# EAGLE design Orgel (EAGLE 7.2.0)
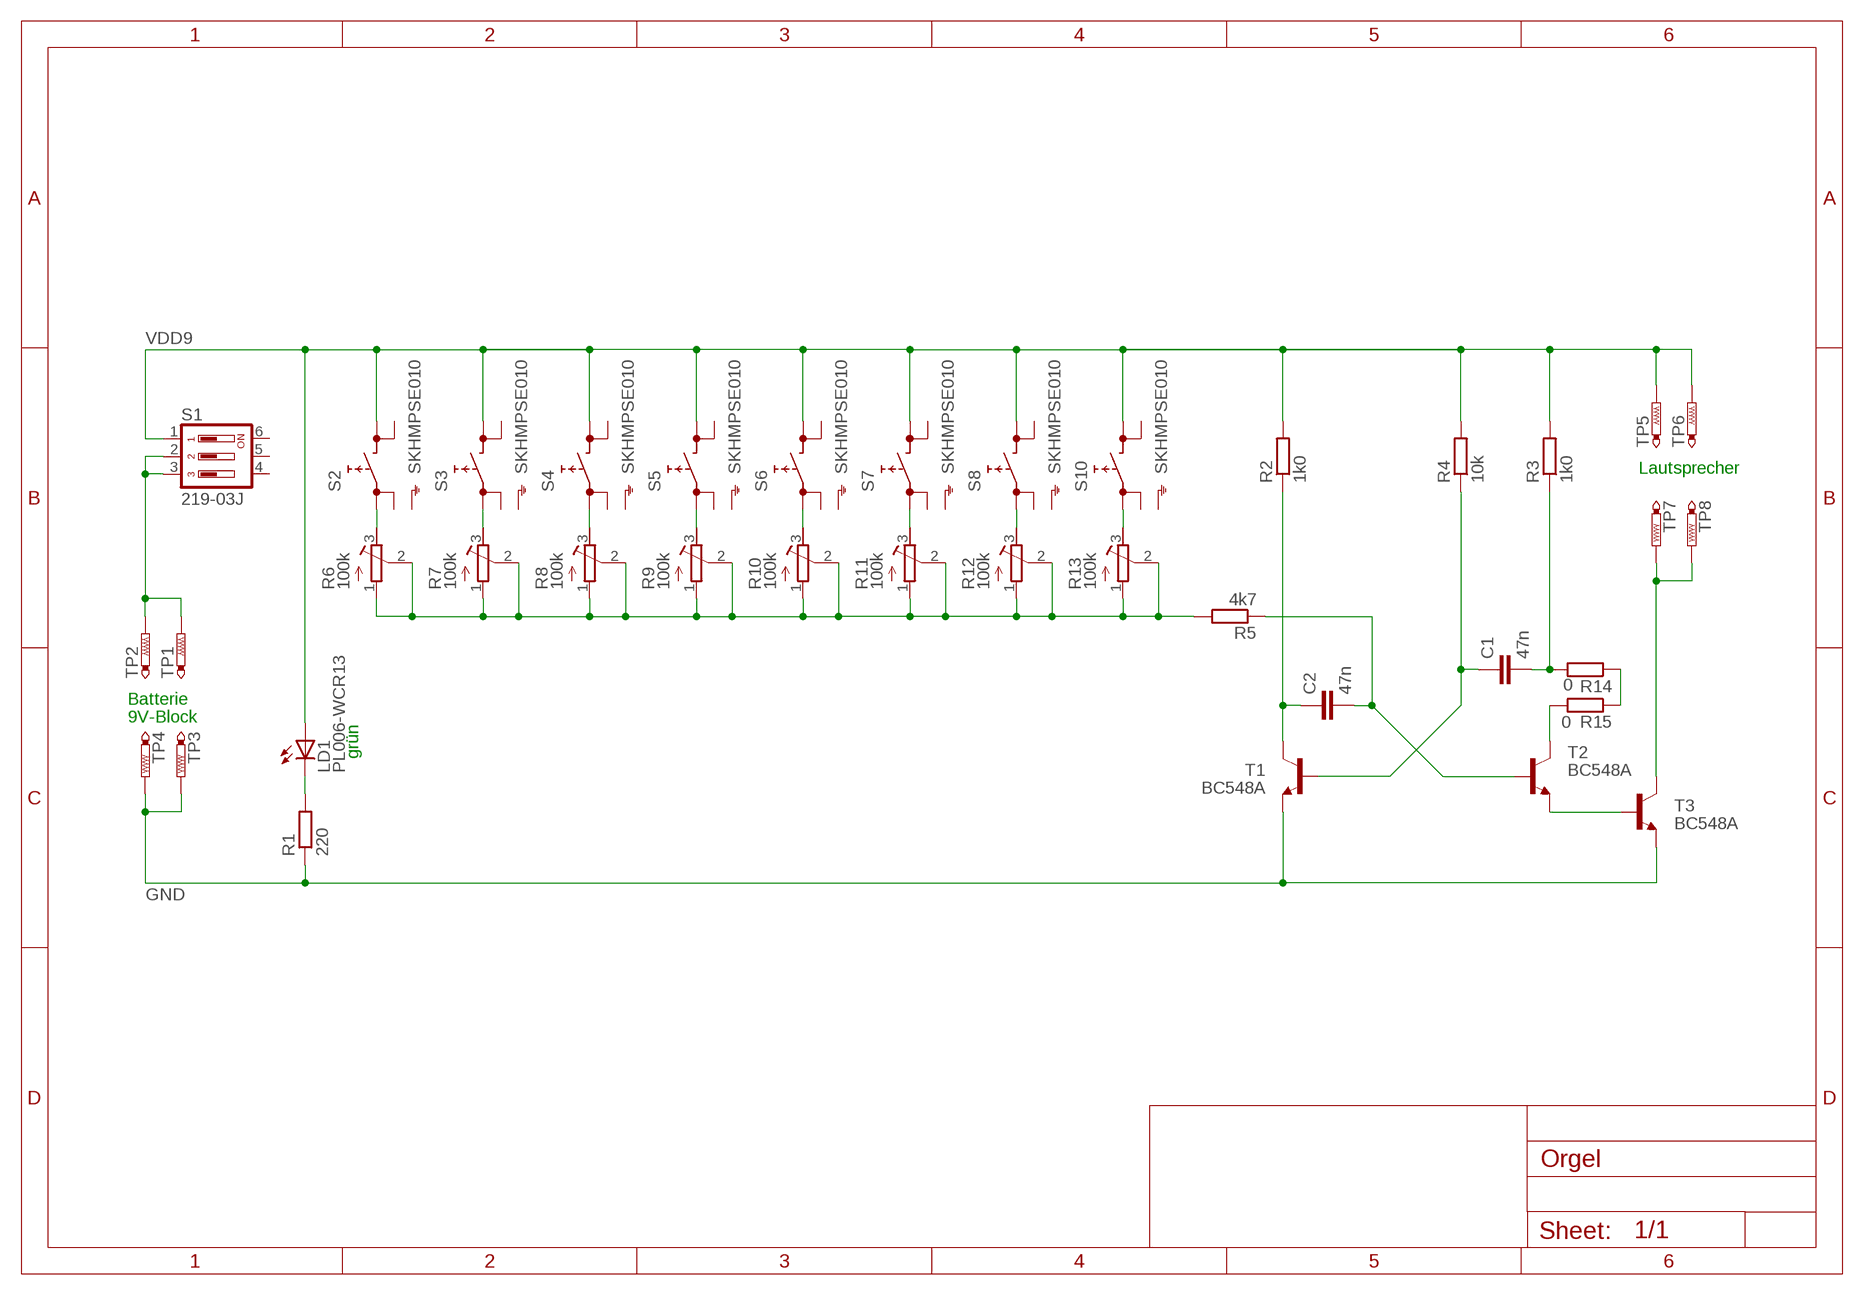
[diagram p0: schematic, sheet 1]

## Parts
C1  47n  C-EUC1206  [C1206]
C2  47n  C-EUC1206  [C1206]
LD1  PL006-WCR13  [SOT23]
R1  220  R-EU_M1206  [M1206]
R2  1k0  R-EU_M1206  [M1206]
R3  1k0  R-EU_M1206  [M1206]
R4  10k  R-EU_M1206  [M1206]
R5  4k7  R-EU_M1206  [M1206]
R6  100k  R-TRIMM5X  [RTRIM5X]
R7  100k  R-TRIMM5X  [RTRIM5X]
R8  100k  R-TRIMM5X  [RTRIM5X]
R9  100k  R-TRIMM5X  [RTRIM5X]
R10  100k  R-TRIMM5X  [RTRIM5X]
R11  100k  R-TRIMM5X  [RTRIM5X]
R12  100k  R-TRIMM5X  [RTRIM5X]
R13  100k  R-TRIMM5X  [RTRIM5X]
R14  0  R-EU_M5923  [M5923]
R15  0  R-EU_M5923  [M5923]
S1  219-03J  [CTS-219-03J]
S2  SKHMPSE010  [SKHMPXE010]
S3  SKHMPSE010  [SKHMPXE010]
S4  SKHMPSE010  [SKHMPXE010]
S5  SKHMPSE010  [SKHMPXE010]
S6  SKHMPSE010  [SKHMPXE010]
S7  SKHMPSE010  [SKHMPXE010]
S8  SKHMPSE010  [SKHMPXE010]
S10  SKHMPSE010  [SKHMPXE010]
T1  BC548A  -NPN-SOT23-EBC  [SOT23-EBC]
T2  BC548A  -NPN-SOT23-EBC  [SOT23-EBC]
T3  BC548A  -NPN-SOT23-EBC  [SOT23-EBC]
TP1  PTR1TP20SQ  [TP20SQ]
TP2  PTR1TP20SQ  [TP20SQ]
TP3  PTR1TP20SQ  [TP20SQ]
TP4  PTR1TP20SQ  [TP20SQ]
TP5  PTR1TP20SQ  [TP20SQ]
TP6  PTR1TP20SQ  [TP20SQ]
TP7  PTR1TP20SQ  [TP20SQ]
TP8  PTR1TP20SQ  [TP20SQ]

## Nets
GND: R1.1 T1.E T3.E TP3.TP TP4.TP
N$1: R6.3(E) S2.1(1.1)
N$2: C2.1 R2.1 T1.C
N$3: LD1.3(C) R1.2
N$4: R5.2 R6.1(A) R6.2(S) R7.1(A) R7.2(S) R8.1(A) R8.2(S) R9.1(A) R9.2(S) R10.1(A) R10.2(S) R11.1(A) R11.2(S) R12.1(A) R12.2(S) R13.1(A) R13.2(S)
N$5: T2.E T3.B
N$6: C2.2 R5.1 T2.B
N$7: S1.2 S1.3 TP1.TP TP2.TP
N$8: C1.2 R3.1 R14.2
N$9: R14.1 R15.1
N$10: R7.3(E) S3.1(1.1)
N$11: R8.3(E) S4.1(1.1)
N$12: R15.2 T2.C
N$13: C1.1 R4.1 T1.B
N$14: R11.3(E) S7.1(1.1)
N$15: R10.3(E) S6.1(1.1)
N$16: R9.3(E) S5.1(1.1)
N$17: T3.C TP7.TP TP8.TP
N$18: R13.3(E) S10.1(1.1)
N$19: R12.3(E) S8.1(1.1)
VDD9: LD1.1(A) R2.2 R3.2 R4.2 S1.1 S2.3(2.1) S3.3(2.1) S4.3(2.1) S5.3(2.1) S6.3(2.1) S7.3(2.1) S8.3(2.1) S10.3(2.1) TP5.TP TP6.TP
Unconnected: S1.4 S1.5 S1.6 S2.2(1.2) S2.4(2.2) S2.5(SH) S3.2(1.2) S3.4(2.2) S3.5(SH) S4.2(1.2) S4.4(2.2) S4.5(SH) S5.2(1.2) S5.4(2.2) S5.5(SH) S6.2(1.2) S6.4(2.2) S6.5(SH) S7.2(1.2) S7.4(2.2) S7.5(SH) S8.2(1.2) S8.4(2.2) S8.5(SH) S10.2(1.2) S10.4(2.2) S10.5(SH)

## Notes on the sheet
- Lautsprecher
- Batterie
- 9V-Block
- grün

## Library data of the parts
C1 C2 = resistor:C-EU: CAPACITOR, European symbol
LD1 = led:PL006*: PLH006 Series SMD LED SOT23 PLH006-WCR21 Super Red PLH006-WCR12 High Eff Red PLH006-WCG13 Green PLH006-WCY01 Yellow www.p-tec.net Source: http://www.wittig-electronic.de/PTEC/PL006Series.pdf
R1-R5 R14 R15 = resistor:R-EU_: RESISTOR, European symbol
R6-R13 = resistor:R-TRIMM: Trimm resistor
S1 = switch-dil:219-03*: Surface Mount DIP Switch Series 219 SMT CTS Electronic Components Sourc: www.ctscorp.com; OC_FARNELL: unknown; OC_NEWARK: unknown
S2-S8 S10 = switch:SKHMP*E010: 6.2 X 6.5mm TACT Switch (SMD) Source: http://www3.alps.co.jp/WebObjects/catalog.woa/PDF/E/Switch/Tact/SKHM/SKHM.PDF
T1-T3 = transistor:*-NPN-: NPN Transistror BF959 corrected 2008.03.06
TP1-TP8 = testpad:PTR1: TEST PIN

## Board
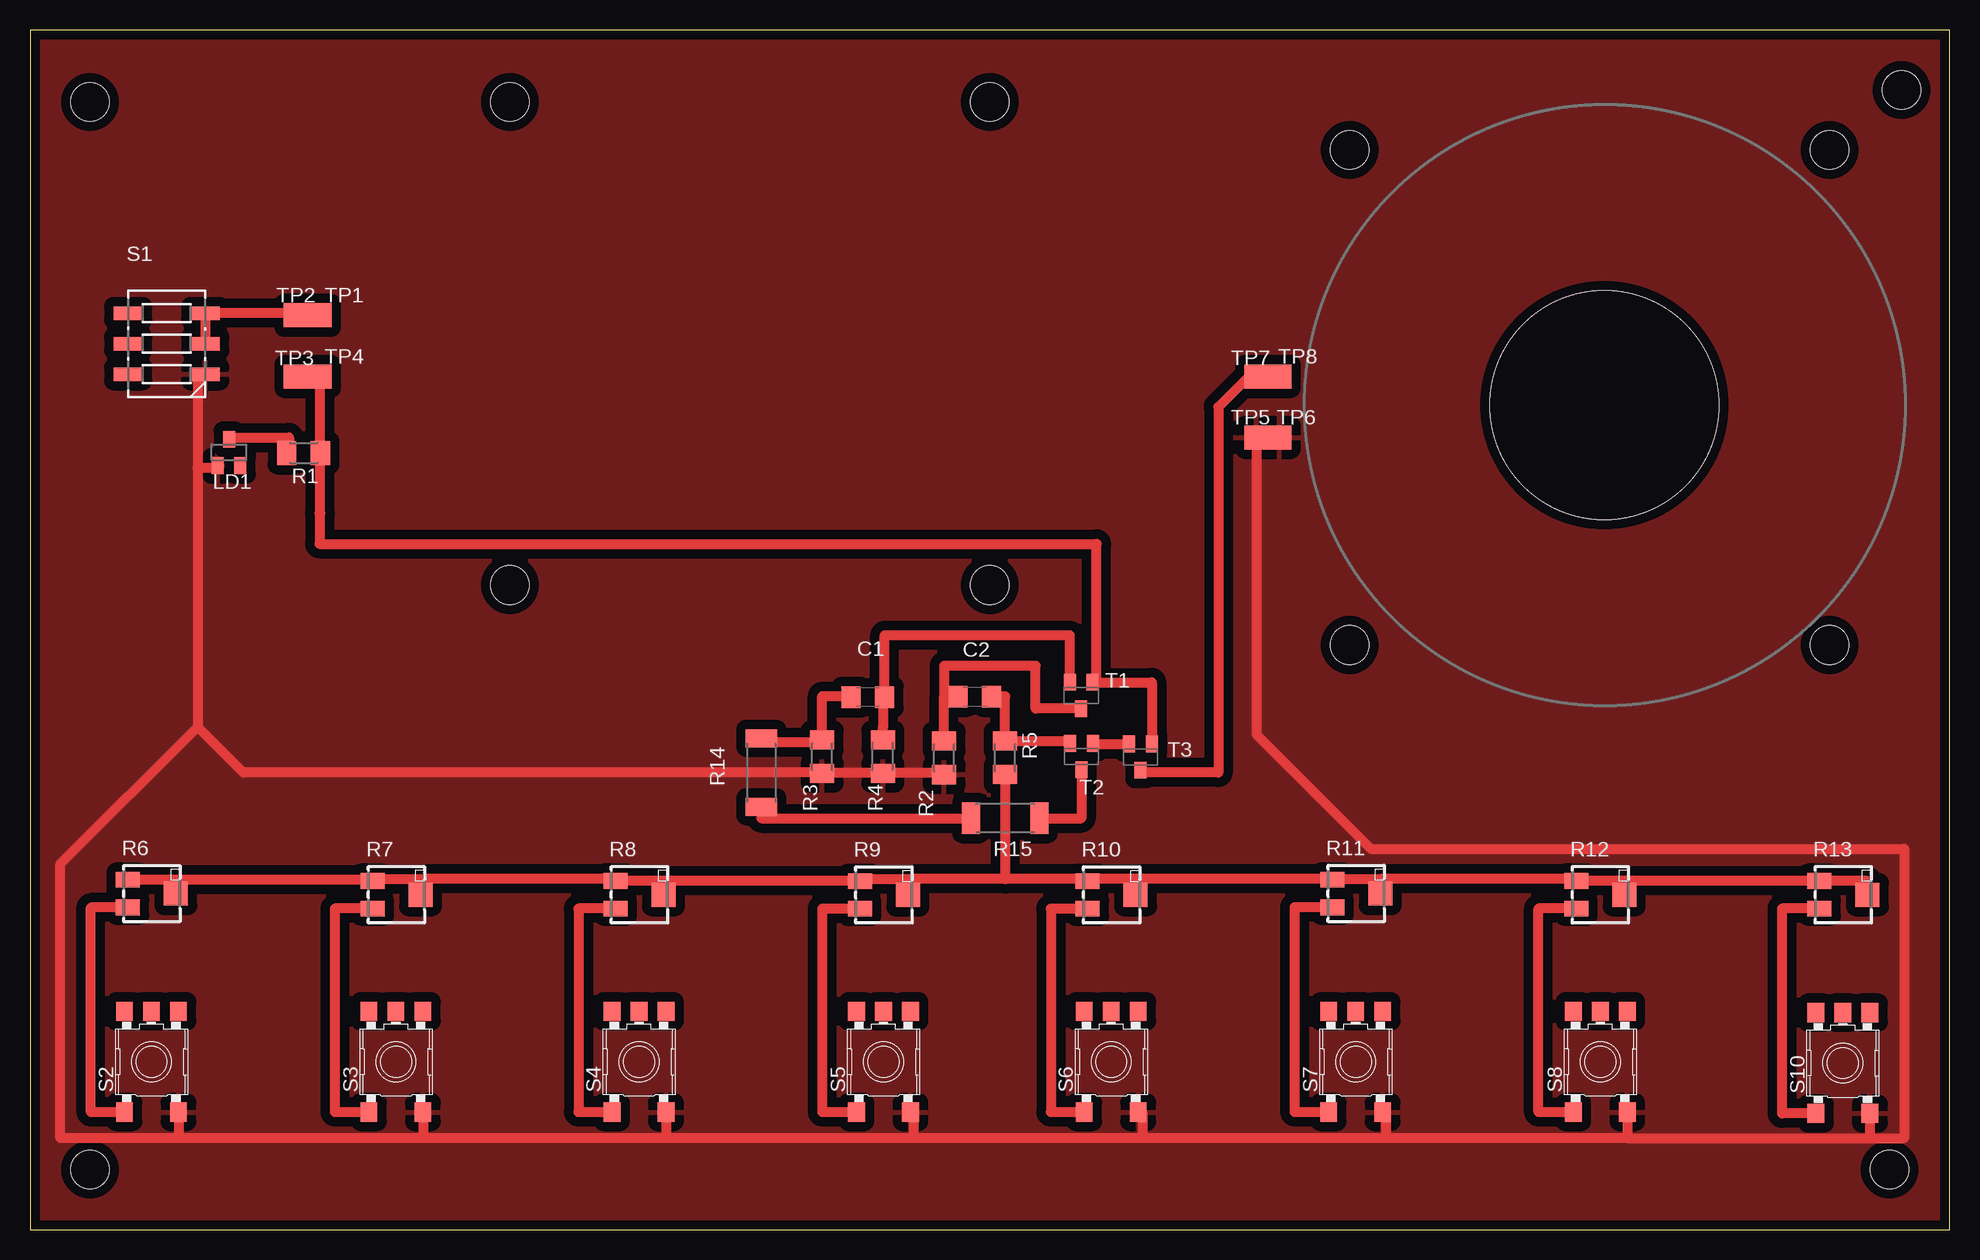
[diagram p1: board, top side]

Size 160 x 100 mm. Coordinates in mm from the lower left corner, seen from the top.
Outline: 0,0 160,0 160,100 0,100 0,0
Copper layers (1*16): Top 0.035mm / dielectric 1.5mm / Bottom 0.035mm
Design rules "FabLab_Trunk *": minimum track width 0.5mm, minimum drill 0.6mm, track to track 0.8mm, track to pad 0.8mm, pad to pad 0.8mm, via to via 0.8mm, smd to smd 8mil, copper to edge 0.8mm, drill to drill 0.8mm, minimum pad ring 10mil, minimum via ring 8mil, stop-mask expansion 4mil, vias tented up to drill 0mil, thermal gap 0.8mm
Holes 3.2 mm at 156,95 5,94 5,5 155,5 150,90 150,48.73 110,48.73 110,90 80,94 40,94 80,53.73 40,53.73
Holes 19.05 mm at 131.24,68.73

### Footprints (pad centres in the part's own frame; a part is rotated, then mirrored left to right if it is on the bottom)
C1206 = smd 1.6 x 1.8: 1 -1.4,0; 2 1.4,0
SOT23 = smd 1 x 1.4: 1 -0.95,-1.1; 2 0.95,-1.1; 3 0,1.1
M1206 = smd 1.6 x 2: 1 -1.4,0; 2 1.4,0
RTRIM5X = smd 1.3 x 2: 1 -1.15,-2; 3 1.15,-2 | smd 2 x 2: 2 0,2
M5923 = smd 1.5 x 2.6: 1 -2.85,0; 2 2.85,0
CTS-219-03J = smd 1.13 x 2.44: 1 -2.54,-3.215; 2 0,-3.215; 3 2.54,-3.215; 4 2.54,3.215; 5 0,3.215; 6 -2.54,3.215
SKHMPXE010 = smd 1.6 x 1.4: 1 -4.2,2.25; 2 4.2,2.25; 3 -4.2,-2.25; 4 4.2,-2.25; 5 4.2,0
SOT23-EBC = smd 1 x 1.4: B 0.95,-1.1; C 0,1.1; E -0.95,-1.1
TP20SQ = smd 2 x 2: TP 0,0

### Placement (x,y rotation side)
C1  69.83,44.37 180 top
C2  78.76,44.43 0 top
LD1  16.59,64.78 0 top
R1  22.8,64.74 180 top
R2  76.19,39.33 270 top
R3  66.04,39.42 270 top
R4  71.08,39.42 270 top
R5  81.27,39.33 270 top
R6  10.16,28 270 top
R7  30.54,27.91 270 top
R8  50.8,27.91 270 top
R9  71.18,27.89 270 top
R10  90.16,27.9 270 top
R11  110.54,28.01 270 top
R12  130.89,27.91 270 top
R13  151.15,27.91 270 top
R14  60.96,38.1 90 top
R15  81.28,34.29 0 top
S1  11.4,73.84 90 top
S2  10.13,13.98 90 top
S3  30.51,13.98 90 top
S4  50.76,13.98 90 top
S5  71.14,13.98 90 top
S6  90.13,13.98 90 top
S7  110.51,13.98 90 top
S8  130.89,13.98 90 top
S10  151.11,13.88 90 top
T1  87.62,44.52 180 top
T2  87.64,39.43 180 top
T3  92.57,39.39 180 top
TP1  24.14,76.22 0 top
TP2  22.16,76.22 0 top
TP3  22.16,71.11 0 top
TP4  24.14,71.11 0 top
TP5  102.23,66.04 0 top
TP6  104.14,66.04 0 top
TP7  102.23,71.12 0 top
TP8  104.14,71.12 0 top

### Tracks (layer width: path | path; a pad name or v marks a point on that pad's centre or on a via)
GND
  Top 0.813: TP3.TP TP4.TP 24.14,64.74 R1.1 24.2,59.69 24.13,59.69 24.13,57.15 88.9,57.15 88.9,45.62 T1.E 93.52,45.62 T3.E
N$1
  Top 0.813: S2.1 5.08,9.78 5.08,26.85 R6.3
N$2
  Top 0.813: R2.1 76.19,44.45 76.2,44.45 | 76.2,44.45 76.2,44.43 C2.1 | T1.C 83.82,43.42 83.82,46.99 76.2,46.99 76.2,44.45
N$3
  Top 0.813: LD1.3 16.59,66.04 21.59,66.04 21.59,64.74 R1.2
N$4
  Top 0.813: R13.2 153.15,29.06 R13.1 132.89,29.06 R12.2 132.89,29.06 R12.1 128.89,29.21 112.54,29.21 | 108.54,29.21 92.16,29.21 | 92.16,29.21 88.16,29.21 | R11.2 112.54,29.21 | R11.1 108.54,29.21 | 108.54,29.21 112.54,29.21 | R10.2 92.16,29.21 | R10.1 88.16,29.21 | 88.16,29.21 81.27,29.21 | 81.27,29.21 73.66,29.21 | 73.66,29.21 73.66,27.89 R9.2 | R9.1 69.18,29.06 | 73.66,29.21 69.18,29.21 69.18,29.06 | 69.18,29.06 52.8,29.06 | 52.8,29.06 R8.1 48.8,29.21 33.02,29.21 | R8.2 52.8,29.06 | 33.02,29.21 33.02,27.91 R7.2 | R7.1 28.54,29.15 | 33.02,29.21 28.54,29.21 28.54,29.15 | 28.54,29.15 12.16,29.15 | 12.16,29.15 R6.1 | R6.2 12.16,29.15 | R5.2 81.27,29.21
N$5
  Top 0.813: T2.E 88.59,40.49 T3.B
N$6
  Top 0.813: C2.2 81.28,44.43 81.28,44.45 81.27,44.45 R5.1 86.36,40.73 T2.B
N$7
  Top 0.813: TP1.TP TP2.TP 22.16,76.38 S1.3 S1.2
N$8
  Top 0.813: C1.2 68.43,44.45 66.04,44.45 R3.1 66.04,40.64 60.96,40.64 R14.2
N$9
  Top 0.813: R14.1 60.96,34.29 R15.1
N$10
  Top 0.813: S3.1 25.4,9.78 25.4,26.76 R7.3
N$11
  Top 0.813: R8.3 45.72,26.76 45.72,9.78 S4.1
N$12
  Top 0.813: T2.C 87.64,34.29 R15.2
N$13
  Top 0.813: T1.B 86.67,49.53 71.23,49.53 C1.1 71.12,44.37 71.12,41.91 71.08,41.91 R4.1
N$14
  Top 0.813: R11.3 105.41,26.86 105.41,9.78 S7.1
N$15
  Top 0.813: R10.3 85.09,26.75 85.09,9.78 S6.1
N$16
  Top 0.813: R9.3 66.04,26.75 66.04,9.78 S5.1
N$17
  Top 0.813: TP7.TP 101.6,71.12 99.06,68.58 99.06,38.1 92.76,38.1 T3.C | TP7.TP 102.87,71.12 | TP8.TP TP7.TP
N$18
  Top 0.813: R13.3 146.05,26.76 146.05,9.68 S10.1
N$19
  Top 0.813: R12.3 125.73,26.76 125.73,9.78 S8.1
VDD9
  Top 0.813: S10.3 153.36,7.62 | 13.97,41.91 2.54,30.48 2.54,7.62 12.38,7.62 | 13.97,63.5 13.97,70.66 S1.1 | 13.97,63.5 13.97,41.91 | LD1.1 15.46,63.5 13.97,63.5 | R2.2 76.19,38.1 71.08,38.1 | TP6.TP TP5.TP 102.23,41.27 111.76,31.75 156.21,31.75 156.21,7.62 153.36,7.62 | 13.97,41.91 17.78,38.1 66.04,38.1 | 133.14,7.62 153.36,7.62 | S8.3 133.14,7.62 | 133.14,7.62 113.03,7.62 | 113.03,7.62 92.71,7.62 | 92.71,7.62 73.66,7.62 | 73.66,7.62 53.01,7.62 | 53.01,7.62 32.76,7.62 | 32.76,7.62 12.38,7.62 | S4.3 53.01,7.62 | S3.3 32.76,7.62 | S2.3 12.38,7.62 | S7.3 113.03,9.78 113.03,7.62 | S5.3 73.66,9.78 73.66,7.62 | S6.3 92.71,9.78 92.71,7.62 | R4.2 71.08,38.1 | R3.2 66.04,38.1 | 66.04,38.1 71.08,38.1
  pour Top: 0,0 0,99.06 160.02,99.06 160.02,21.59 160.02,0

### Text on the board
tDocu: Batterie | Lautsprecher